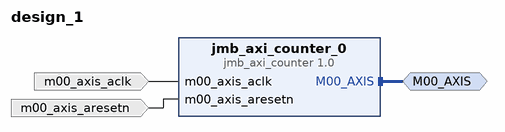
[diagram p0: block diagram of the top level]
# Vivado block design design_1, Vivado 2014.2
create_bd_design design_1

create_bd_intf_port -mode Master -vlnv xilinx.com:interface:axis_rtl:1.0 M00_AXIS
create_bd_port -dir I -type clk m00_axis_aclk
set_property -dict {CONFIG.FREQ_HZ 100000000} [get_bd_ports m00_axis_aclk]
create_bd_port -dir I -type rst m00_axis_aresetn

create_bd_cell -type ip -vlnv RIT:user:jmb_axi_counter:1.0 jmb_axi_counter_0

# ---- connections ----

connect_bd_intf_net [get_bd_intf_ports M00_AXIS] [get_bd_intf_pins jmb_axi_counter_0/M00_AXIS]
connect_bd_net [get_bd_ports m00_axis_aclk] [get_bd_pins jmb_axi_counter_0/m00_axis_aclk]
connect_bd_net [get_bd_ports m00_axis_aresetn] [get_bd_pins jmb_axi_counter_0/m00_axis_aresetn]

validate_bd_design
save_bd_design
